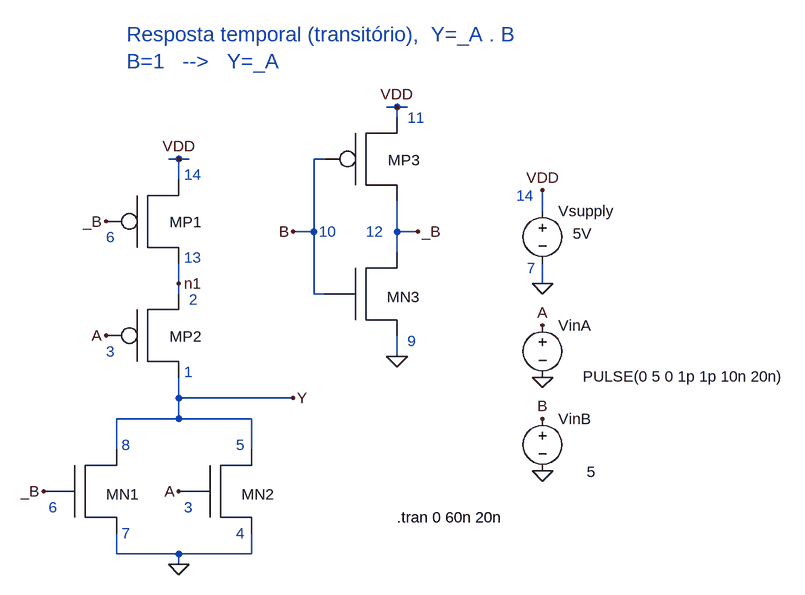
[diagram p0: schematic static-gate-delay.asc]
static-gate-delay.asc, the LTspice schematic file:
Version 4
SHEET 1 2472 680
WIRE 384 -128 368 -128
WIRE 400 -128 384 -128
WIRE 384 -112 384 -128
WIRE 48 -48 32 -48
WIRE 64 -48 48 -48
WIRE 272 -48 256 -48
WIRE 48 -16 48 -48
WIRE 608 32 608 0
WIRE 256 64 256 -48
WIRE 256 64 224 64
WIRE 384 64 384 16
WIRE 416 64 384 64
WIRE 384 96 384 64
WIRE 48 144 48 112
WIRE 608 144 608 112
WIRE 48 160 48 144
WIRE 256 160 256 64
WIRE 272 160 256 160
WIRE 384 256 384 224
WIRE 48 320 48 288
WIRE 224 320 48 320
WIRE 48 352 48 320
WIRE 48 352 -48 352
WIRE 160 352 48 352
WIRE -48 400 -48 352
WIRE 160 400 160 352
WIRE -48 560 -48 528
WIRE 48 560 -48 560
WIRE 160 560 160 528
WIRE 160 560 48 560
WIRE 48 576 48 560
FLAG 608 144 0
FLAG 608 288 0
FLAG 608 432 0
FLAG 608 0 VDD
FLAG 608 208 A
FLAG 608 352 B
FLAG 384 -128 VDD
FLAG 224 64 B
FLAG 416 64 _B
FLAG 48 -48 VDD
FLAG -64 48 _B
FLAG -160 464 _B
FLAG -64 224 A
FLAG 48 464 A
FLAG 224 320 Y
FLAG 48 144 n1
FLAG 384 256 0
FLAG 48 576 0
SYMBOL voltage 608 16 R0
WINDOW 3 47 51 Left 2
SYMATTR Value 5V
SYMATTR InstName Vsupply
SYMBOL voltage 608 192 R0
WINDOW 123 0 0 Left 2
WINDOW 39 0 0 Left 2
WINDOW 3 62 95 Left 2
SYMATTR Value PULSE(0 5 0 1p 1p 10n 20n)
SYMATTR InstName VinA
SYMBOL voltage 608 336 R0
WINDOW 123 0 0 Left 2
WINDOW 39 0 0 Left 2
WINDOW 3 68 98 Left 2
SYMATTR Value 5
SYMATTR InstName VinB
SYMBOL PMOSX 16 32 R0
SYMATTR InstName MP1
SYMBOL PMOSX 16 208 R0
SYMATTR InstName MP2
SYMBOL PMOSX 352 -64 R0
SYMATTR InstName MP3
SYMBOL NMOSX -80 448 R0
SYMATTR InstName MN1
SYMBOL NMOSX 128 448 R0
SYMATTR InstName MN2
SYMBOL NMOSX 352 144 R0
SYMATTR InstName MN3
TEXT 384 504 Left 2 !.tran 0 60n 20n
TEXT 568 8 Left 2 ;14
TEXT 584 120 Left 2 ;7
TEXT -32 -240 Left 3 ;Resposta temporal (transitório),  Y=_A . B\nB=1   -->   Y=_A
TEXT -64 72 Left 2 ;6
TEXT -152 488 Left 2 ;6
TEXT -64 248 Left 2 ;3
TEXT 56 488 Left 2 ;3
TEXT 56 -24 Left 2 ;14
TEXT 56 104 Left 2 ;13
TEXT -40 392 Left 2 ;8
TEXT -40 528 Left 2 ;7
TEXT 136 392 Left 2 ;5
TEXT 136 528 Left 2 ;4
TEXT 64 168 Left 2 ;2
TEXT 56 280 Left 2 ;1
TEXT 264 64 Left 2 ;10
TEXT 400 -112 Left 2 ;11
TEXT 336 64 Left 2 ;12
TEXT 400 232 Left 2 ;9

The netlist it stands for:
* static-gate-delay.asc
Vsupply VDD 0 5V
VinA A 0 PULSE(0 5 0 1p 1p 10n 20n)
VinB B 0 5
XMP1 n1 _B VDD PMOSX  ; pins D G S
XMP2 Y A n1 PMOSX  ; pins D G S
XMP3 _B B VDD PMOSX  ; pins D G S
XMN1 Y _B 0 NMOSX  ; pins D G S
XMN2 Y A 0 NMOSX  ; pins D G S
XMN3 _B B 0 NMOSX  ; pins D G S
.tran 0 60n 20n
* 14
* 7
* Resposta temporal (transitório),  Y=_A . B
* B=1   -->   Y=_A
* 6
* 6
* 3
* 3
* 14
* 13
* 8
* 7
* 5
* 4
* 2
* 1
* 10
* 11
* 12
* 9
.lib MOS4007.txt
.backanno
.end